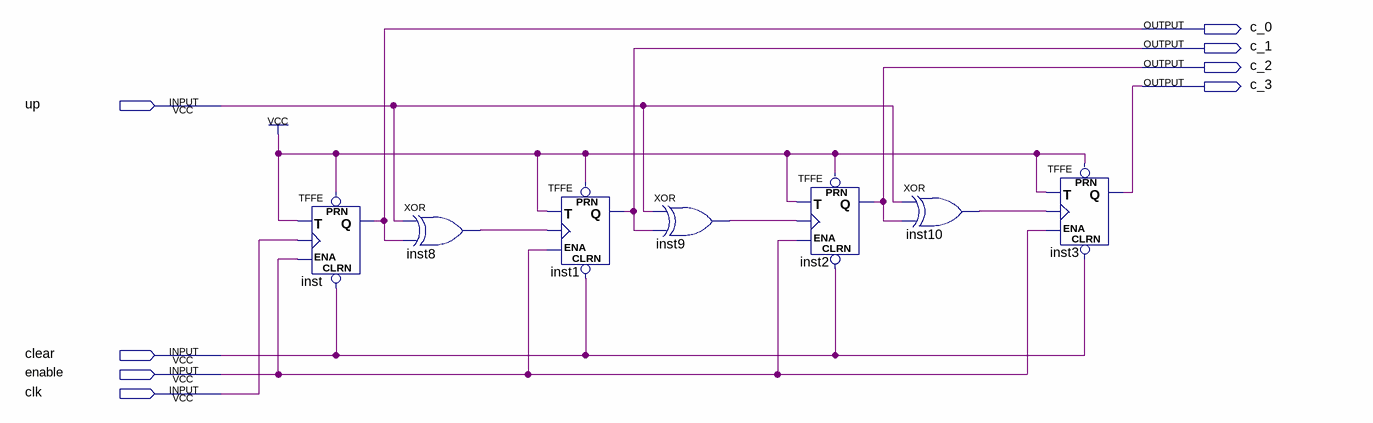
[diagram p0: schematic sheet]
// Quartus schematic Counter_4bit.bdf as structural Verilog: 7 symbols, 8 pins
module Counter_4bit (
  input  up,
  input  clear,
  input  enable,
  input  clk,
  output c_0,
  output c_1,
  output c_2,
  output c_3
);

  wire inst8_out, inst9_out, inst10_out;

  TFFE inst (.CLRN(clear), .T(1'b1), .CLK(clk), .ENA(enable), .PRN(1'b1), .Q(c_0));
  xor inst8 (inst8_out, up, c_0);
  TFFE inst1 (.CLRN(clear), .T(1'b1), .CLK(inst8_out), .ENA(enable), .PRN(1'b1), .Q(c_1));
  xor inst9 (inst9_out, up, c_1);
  TFFE inst2 (.CLRN(clear), .T(1'b1), .CLK(inst9_out), .ENA(enable), .PRN(1'b1), .Q(c_2));
  xor inst10 (inst10_out, up, c_2);
  TFFE inst3 (.CLRN(clear), .T(1'b1), .CLK(inst10_out), .ENA(enable), .PRN(1'b1), .Q(c_3));
endmodule
